# Altium schematic sheet ESP32.SchDoc
size A; SheetNumber: 1; SheetTotal: 4
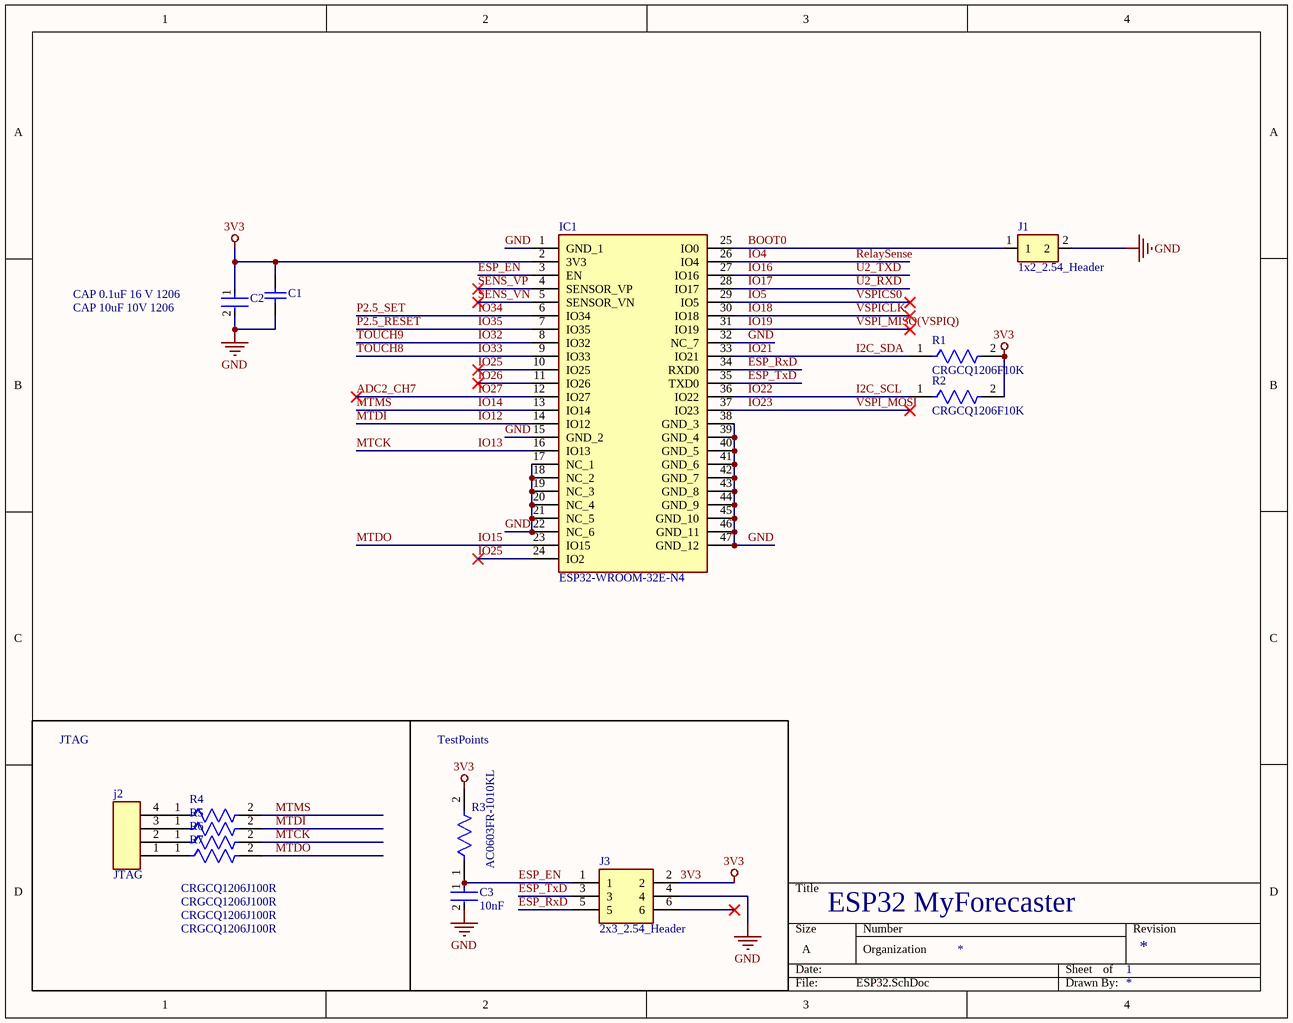
[diagram p0: ESP32.SchDoc]

## Parts
C1  CAP 10uF 10V 1206  [CAPC1206(3216)190_N]
C2  CAP 0.1uF 16 V 1206  [FP-C1206C-EB-MFG]
C3  10nF  [FP-CL10-IPC_B]
IC1  ESP32-WROOM-32E-N4  [ESP32WROOM32EN4]
J1  1x2_2.54_Header  [1x2_2.54_Header]
j2  JTAG  [1x4_2.54_Header]
J3  2x3_2.54_Header  [2x3_2.54_Header]
R1  CRGCQ1206F10K  [FP-CRGCQ1206-IPC_C]
R2  CRGCQ1206F10K  [FP-CRGCQ1206-IPC_C]
R3  AC0603FR-1010KL  [FP-AC0603-IPC_B]
R4  CRGCQ1206J100R  [FP-CRGCQ1206-IPC_C]
R5  CRGCQ1206J100R  [FP-CRGCQ1206-IPC_C]
R6  CRGCQ1206J100R  [FP-CRGCQ1206-IPC_C]
R7  CRGCQ1206J100R  [FP-CRGCQ1206-IPC_C]

## Blocks framed on the sheet
JTAG: j2 R4-R7

## Nets
3V3: C1.2 C2.1 IC1.2(3V3) J3.2 R1.2 R2.2 R3.2
GND: C1.1 C2.2 C3.2 IC1.1(GND_1) IC1.15(GND_2) IC1.17(NC_1) IC1.18(NC_2) IC1.19(NC_3) IC1.20(NC_4) IC1.21(NC_5) IC1.22(NC_6) IC1.32(NC_7) IC1.38(GND_3) IC1.39(GND_4) IC1.40(GND_5) IC1.41(GND_6) IC1.42(GND_7) IC1.43(GND_8) IC1.44(GND_9) IC1.45(GND_10) IC1.46(GND_11) IC1.47(GND_12) J1.2 J3.4
ADC2_CH7: IC1.12(IO27)  [also labelled IO27]
BOOT0: IC1.25(IO0) J1.1
ESP_EN: C3.1 IC1.3(EN) J3.1 R3.1
ESP_RxD: IC1.34(RXD0) J3.5
ESP_TxD: IC1.35(TXD0) J3.3
I2C_SCL: IC1.36(IO22) R2.1  [also labelled IO22]
I2C_SDA: IC1.33(IO21) R1.1  [also labelled IO21]
IO4: IC1.26(IO4)  [also labelled RelaySense]
IO5: IC1.29(IO5)  [also labelled VSPICS0]
IO12: IC1.14(IO12) R5.2  [also labelled MTDI]
IO13: IC1.16(IO13) R6.2  [also labelled MTCK]
IO14: IC1.13(IO14) R4.2  [also labelled MTMS]
IO15: IC1.23(IO15) R7.2  [also labelled MTDO]
IO16: IC1.27(IO16)  [also labelled U2_TXD]
IO17: IC1.28(IO17)  [also labelled U2_RXD]
IO18: IC1.30(IO18)  [also labelled VSPICLK]
IO19: IC1.31(IO19)  [also labelled VSPI_MISO(VSPIQ)]
IO23: IC1.37(IO23)  [also labelled VSPI_MOSI]
IO25: IC1.10(IO25) IC1.24(IO2)
IO26: IC1.11(IO26)
IO32: IC1.8(IO32)  [also labelled TOUCH9]
IO33: IC1.9(IO33)  [also labelled TOUCH8]
IO34: IC1.6(IO34)  [also labelled P2.5_SET]
IO35: IC1.7(IO35)  [also labelled P2.5_RESET]
SENS_VN: IC1.5(SENSOR_VN)
SENS_VP: IC1.4(SENSOR_VP)
Netj2_1: j2.1 R7.1
Netj2_2: j2.2 R6.1
Netj2_3: j2.3 R5.1
Netj2_4: j2.4 R4.1

Not connected (* = marked no-connect by the designer): J3 6*

## Notes on the sheet
- TestPoints
- ESP32 MyForecaster
- Organization

## Library data of the parts
C1 = CMP-1037-04966-1: CAP 10uF 10V ±5% 1206 (3216 Metric) Thickness 1.9mm SMD; Case-Metric: 3216; Case-EIA: 1206; Tolerance: Â±5%; Max Thickness: 1.9 mm; Value: 10uF; Rated Voltage: 10 V; Technology: SMT
C2 = CMP-03020-018021-2: C1206 0.10 μF X7R 10.00% 16 V; Manufacturer Part Number: C1206C104K4RACAUTO; Manufacturer: KEMET; Automotive Grade: Grade 0; Tolerance: 0.1; Temperature Coefficient: 15%; Material: Ceramic; Capacitance: 0.10 μF; Value: 0.10 μF; Voltage Rating: 16 V; Package: C1206C-EB; Device Class L2: Capacitors; ComponentLink2URL: https://content.kemet.com/datasheets/KEM_C1007_X8R_ULTRA_150C_SMD.pdf; RoHS: TRUE; Height: 0.88mm; Device Class L1: Passive Components; Temperature Range Low: -55°C; Category: Cap; Octopart: https://octopart.com/c1206c104k4racauto-kemet-95437231; Lead Free: Yes; Temperature Characteristic: X7R; Temperature Range High: +150°C; Device Class L3: Ceramic Capacitors; Temperature: -55°C to +150°C; Ipc Land Pattern Name: CAPC320160X78; Automotive: Yes; ComponentLink2Description: Datasheet
C3 = CMP-13271-004285-1: Cap Ceramic 10nF 25V X7R ±10% Pad SMD 0603 +125°C T/R; Voltage: 50V; Height: 0.8mm; Tolerance: 10%; Package Quantity: 4000; Width: 0.031inch; Case/Package: 0603; Thickness: 0.035inch; Capacitance: 10nF; Packaging: Tape and Reel; Min Operating Temperature: -55°C; RoHS Compliant: Yes; Voltage Rating: 25V; Case Code (Imperial): 0603; Radiation Hardening: No; Depth: 0.8mm; Series: CL; Contact Plating: Tin; Mount: Surface Mount; Construction: Flat; Case Code (Metric): 1608; Length: 1.6mm; Max Operating Temperature: 125°C; Dielectric: X7R
IC1 = ESP32-WROOM-32E-N4: Integrated Circuit; Manufacturer_Name: Espressif Systems; Datasheet Link: https://www.espressif.com/sites/default/files/documentation/esp32-wroom-32e_esp32-wroom-32ue_datasheet_en.pdf; Height: 3.25mm; Manufacturer_Part_Number: ESP32-WROOM-32E-N4; Mouser Part Number: 356-ESP32WRM32E132PH; Mouser Price/Stock: https://www.mouser.co.uk/ProductDetail/Espressif-Systems/ESP32-WROOM-32E-N4?qs=Li%252BoUPsLEnsPzTWsi%252BRMgQ%3D%3D
J1 = 1x2_2.54_Header: Connector
j2 = 1x4_2.54_Header: Connector
J3 = 2x3_2.54_Header: Connector; Manufacturer_Name: TE Connectivity; Manufacturer_Part_Number: 5-146254-3; Datasheet Link: https://4donline.ihs.com/images/VipMasterIC/IC/TYEL/TYEL-S-A0002895876/TYEL-S-A0002895876-1.pdf?hkey=52A5661711E402568146F3353EA87419; Height: 8.21mm; Mouser Part Number: 571-5-146254-3; Mouser Price/Stock: https://www.mouser.co.uk/ProductDetail/TE-Connectivity/5-146254-3?qs=bwpFY26eRVeBoCoMAqhLNw%3D%3D; Arrow Part Number: 5-146254-3; Arrow Price/Stock: https://www.arrow.com/en/products/5-146254-3/te-connectivity?utm_currency=USD&region=nac
R1 R2 = CMP-03211-010884-1: CRGCQ1206 10KΩ 0.25W 1% ±100ppm/°C 200V; Manufacturer: TE Connectivity; Tolerance: 0.01; Automotive Grade: Grade 913; Value: 10KΩ; Automotive: Yes; Temperature: -55°C to +155°C; RoHS: TRUE; Series: CRGCQ; Lead Free: Yes; Device Class L3: Chip SMD Resistors; Package: CRGCQ1206; ComponentLink2URL: https://www.te.com/commerce/DocumentDelivery/DDEController?Action=showdoc&DocId=Data+Sheet%7F1773204-3%7F1%7Fpdf%7FEnglish%7FENG_DS_1773204-3_1.pdf%7F4-2176347-922; Ipc Land Pattern Name: RESC310155X55; Composition: Thick Film; Voltage Rating: 200V; Device Class L1: Passive Components; Temperature Range Low: -55°C; Resistance: 10KΩ; Height: 0.65mm; Power Rating: 0.25W; Device Class L2: Resistors; Temperature Range High: +155°C; Octopart: https://octopart.com/crgcq1206f10k-te+connectivity-91018244; Ambient Temperature Range High: +70°C; ComponentLink2Description: Datasheet; Temperature Coefficient: ±100ppm/°C; Manufacturer Part Number: CRGCQ1206F10K; Category: Res
R3 = CMP-03412-017743-2: RES 10KΩ 1.00% 0.1W 0603; Tolerance: 1%; Resistance: 10kR; Voltage Rating: 50V; Temperature Coefficient: 100ppm/°C; Power Rating: 100mW; RoHS Compliant: Yes; Max Operating Temperature: 155°C; Min Operating Temperature: -55°C; Width: 0.8mm; Packaging: Tape and Reel; Height: 0.45mm; Termination: SMD/SMT; Length: 1.6mm; Weight: 7.1E-05oz; Case Code (Imperial): 0603; Case Code (Metric): 1608; Series: AC; Case/Package: 0603
R4-R7 = CMP-03211-011244-1: CRGCQ1206 100Ω 0.25W 5% ±200ppm/°C 200V; Manufacturer: TE Connectivity; Automotive Grade: Grade 458; Tolerance: 0.05; Temperature: -55°C to +155°C; Device Class L3: Chip SMD Resistors; Power Rating: 0.25W; ComponentLink2URL: https://www.te.com/commerce/DocumentDelivery/DDEController?Action=showdoc&DocId=Data+Sheet%7F1773204-3%7F1%7Fpdf%7FEnglish%7FENG_DS_1773204-3_1.pdf%7F4-2176347-467; Temperature Range Low: -55°C; Automotive: Yes; Lead Free: Yes; Voltage Rating: 200V; Device Class L2: Resistors; Height: 0.65mm; ComponentLink2Description: Datasheet; Ipc Land Pattern Name: RESC310155X55; Category: Res; RoHS: TRUE; Temperature Coefficient: ±200ppm/°C; Octopart: https://octopart.com/crgcq1206j100r-te+connectivity-91018304; Value: 100Ω; Manufacturer Part Number: CRGCQ1206J100R; Ambient Temperature Range High: +70°C; Device Class L1: Passive Components; Temperature Range High: +155°C; Package: CRGCQ1206; Composition: Thick Film; Series: CRGCQ; Resistance: 100Ω